# Altium project IMU sensor node hardware.PrjPcb
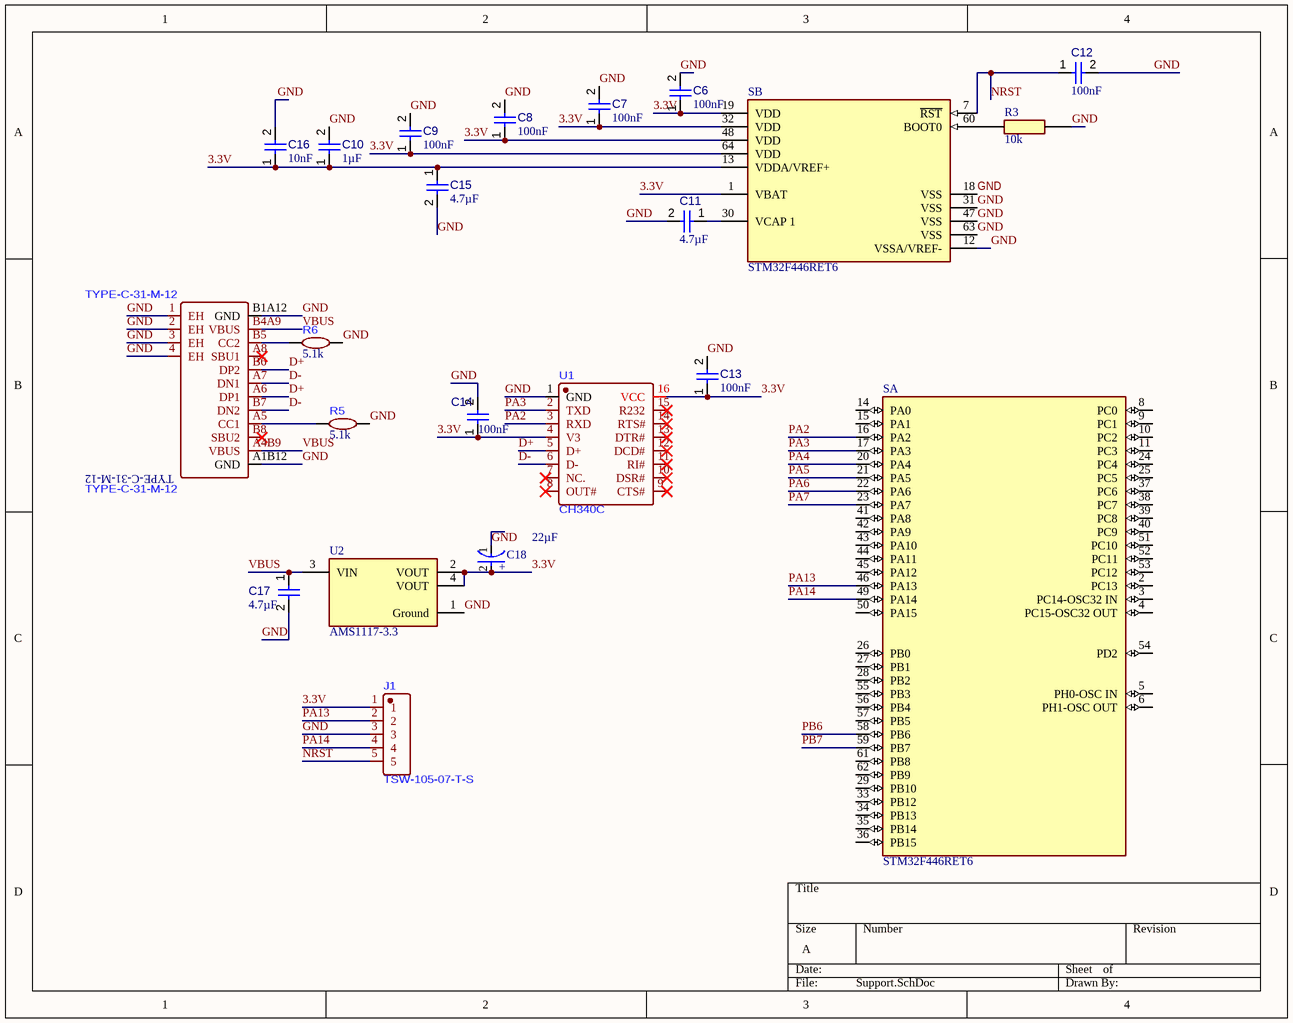
[diagram p0: Support.SchDoc]
1 sheet, 21 parts. Net scope: global (net labels, ports and power ports of the same name join across sheets).
Board file: IMU_sensor_node_hardware.PcbDoc

## Sheet Support.SchDoc
size A; SheetNumber: 1; SheetTotal: 2

### Parts
C6  value 100nF  [CAPC1608X90X40NL10T20]  (hidden comment: Capacitor 100 nF +/-10% 50 V 0603)
C7  value 100nF  [CAPC1608X90X40NL10T20]  (hidden comment: Capacitor 100 nF +/-10% 50 V 0603)
C8  value 100nF  [CAPC1608X90X40NL10T20]  (hidden comment: Capacitor 100 nF +/-10% 50 V 0603)
C9  value 100nF  [CAPC1608X90X40NL10T20]  (hidden comment: Capacitor 100 nF +/-10% 50 V 0603)
C10  value 1µF  [CAPC0603(1608)100_L]  (hidden comment: Capacitor 1µF +/-40% 50V 0603)
C11  value 4.7µF  [CAPC0603(1608)100_L]  (hidden comment: Capacitor 4.7µF +/-20% 10V 0603)
C12  value 100nF  [CAPC1608X90X40NL10T20]  (hidden comment: Capacitor 100 nF +/-10% 50 V 0603)
C13  value 100nF  [CAPC1608X90X40NL10T20]  (hidden comment: Capacitor 100 nF +/-10% 50 V 0603)
C14  value 100nF  [CAPC1608X90X40NL10T20]  (hidden comment: Capacitor 100 nF +/-10% 50 V 0603)
C15  value 4.7µF  [CAPC0603(1608)100_L]  (hidden comment: Capacitor 4.7µF +/-20% 10V 0603)
C16  value 10nF  [CAPC0402(1005)60_L]  (hidden comment: Capacitor 10nF +/-20% 50V 0402)
C17  value 4.7µF  [CAPC0603(1608)100_L]  (hidden comment: Capacitor 4.7µF +/-20% 10V 0603)
C18  value 22µF  [FP-TAJA-MFG]  (hidden comment: TAJA226M010RNJ)
J1  TSW-105-07-T-S  [PCBComponent_1]
R3  value 10k  [RESC1005X40N]  (hidden comment: 0402WGF1002TCE)
R5  value 5.1k  [PCBComponent_1]  (hidden comment: 0603WAF5101T5E)
R6  value 5.1k  [PCBComponent_1]  (hidden comment: 0603WAF5101T5E)
S  STM32F446RET6  [FP-LQFP64-5W-MFG]  (parts A,B of 2)
TYPE-C-31-M-12  TYPE-C-31-M-12  [PCBComponent_1]
U1  CH340C  [PCBComponent_1]
U2  AMS1117-3.3  [FP-AMS1117-IPC_A]

### Nets
3.3V: C6.1 C7.1 C8.1 C9.1 C10.1 C13.1 C14.1 C15.1 C16.1 C18.2(A) J1.1 S.1(VBAT) S.13(VDDA/VREF+) S.19(VDD) S.32(VDD) S.48(VDD) S.64(VDD) U1.4(V3) U1.16(VCC) U2.2(VOUT) U2.4(VOUT)
D+: TYPE-C-31-M-12.A6(DP1) TYPE-C-31-M-12.B6(DP2) U1.5(D+)
D-: TYPE-C-31-M-12.A7(DN1) TYPE-C-31-M-12.B7(DN2) U1.6(D-)
GND: C6.2 C7.2 C8.2 C9.2 C10.2 C11.2 C12.2 C13.2 C14.2 C15.2 C16.2 C17.2 C18.1(C) J1.3 R3.2 R5.2 R6.2 S.12(VSSA/VREF-) S.18(VSS) S.31(VSS) S.47(VSS) S.63(VSS) TYPE-C-31-M-12.1(EH) TYPE-C-31-M-12.2(EH) TYPE-C-31-M-12.3(EH) TYPE-C-31-M-12.4(EH) TYPE-C-31-M-12.A1B12(GND) TYPE-C-31-M-12.B1A12(GND) U1.1(GND) U2.1(Ground)
NRST: C12.1 J1.5 S.7(~{RST})
PA2: S.16(PA2) U1.3(RXD)
PA3: S.17(PA3) U1.2(TXD)
PA4: S.20(PA4)
PA5: S.21(PA5)
PA6: S.22(PA6)
PA7: S.23(PA7)
PA13: J1.2 S.46(PA13)
PA14: J1.4 S.49(PA14)
PB6: S.58(PB6)
PB7: S.59(PB7)
VBUS: C17.1 TYPE-C-31-M-12.A4B9(VBUS) TYPE-C-31-M-12.B4A9(VBUS) U2.3(VIN)
NetC11_1: C11.1 S.30(VCAP_1)
NetR3_1: R3.1 S.60(BOOT0)
NetR5_1: R5.1 TYPE-C-31-M-12.A5(CC1)
NetR6_1: R6.1 TYPE-C-31-M-12.B5(CC2)

Not connected (* = marked no-connect by the designer): S 2(PC13) 3(PC14-OSC32_IN) 4(PC15-OSC32_OUT) 5(PH0-OSC_IN) 6(PH1-OSC_OUT) 8(PC0) 9(PC1) 10(PC2) 11(PC3) 14(PA0) 15(PA1) 24(PC4) 25(PC5) 26(PB0) 27(PB1) 28(PB2) 29(PB10) 33(PB12) 34(PB13) 35(PB14) 36(PB15) 37(PC6) 38(PC7) 39(PC8) 40(PC9) 41(PA8) 42(PA9) 43(PA10) 44(PA11) 45(PA12) 50(PA15) 51(PC10) 52(PC11) 53(PC12) 54(PD2) 55(PB3) 56(PB4) 57(PB5) 61(PB8) 62(PB9); TYPE-C-31-M-12 A8(SBU1)* B8(SBU2)*; U1 7(NC.)* 8(OUT#)* 9(CTS#)* 10(DSR#)* 11(RI#)* 12(DCD#)* 13(DTR#)* 14(RTS#)* 15(R232)*

### Notes on the sheet
- (in symbol CMP-00000-1) +

### Library data of the parts
C6-C9 C12-C14 = CMP-001-00017-6: Chip Capacitor, 100 nF, +/- 10%, 50 V, 0603 (1608 Metric); Voltage Rating: 50V; Capacitor Type: Ceramic; Tolerance: 10%; Mounting Technology: SM; Max Operating Temperature: 125°C; RoHS Compliant: True; Pins: 2; Case/Package: 0603; Min Operating Temperature: -55°C
C10 = CMP-001-00078-4: Chip Capacitor, 1µF +/-40%, 50V, 0603, Thickness 1 mm; Tolerance: 10%; Case/Package: 0603; Pins: 2; Max Operating Temperature: 85°C; Voltage Rating: 50V; Mounting Technology: SMT; Min Operating Temperature: -55°C
C11 C15 C17 = CMP-001-00076-4: Chip Capacitor, 4.7µF +/-20%, 10V, 0603, Thickness 1 mm; Tolerance: 10%; Mounting Technology: SMT; Case/Package: 0603; Pins: 2; Min Operating Temperature: -55°C; Max Operating Temperature: 85°C; Voltage Rating: 10V
C16 = CMP-001-00069-3: Chip Capacitor, 10nF +/-20%, 50V, 0402, Thickness 0.6 mm; Tolerance: 5%; Max Operating Temperature: 85°C; Pins: 2; Case/Package: 0402; Voltage Rating: 50V; Min Operating Temperature: -55°C; Mounting Technology: SMT
C18 = CMP-00000-1: Cap Tant Solid 22uF 10V A CASE 20%( 3.2 X 1.6 X 1.6mm) Inward L SMD 3216-18 3 Ohm 125C T/R; Polarity: Polar; Dielectric Material: Tantalum; Dissipation Factor: 8%; ESR (Equivalent Series Resistance): 3Ω; Life (Hours): 2000hours; Leakage Current: 2.2µA; Ripple Current: 63mA; Length: 3.2mm; Tolerance: 20%; Depth: 1.6mm; Number of Terminals: 2; Export Control Classification Number (ECCN) Code: EAR99; Voltage: 10V; Termination: SMD/SMT; Min Operating Temperature: -55°C; Mounting Technology: Surface Mount; Pins: 2; Features: General Purpose; Introduction Date: 2005-08-24; Case Code (Metric): 3216; Height: 1.6mm; Lead Pitch: 1.1mm; Case Code (Imperial): 1206; REACH SVHC: Yes; Harmonized Tariff Schedule (HTS) Code: 8532.21.00.50; Height - Seated (Max): 1.8034mm; Radiation Hardening: No; Max Operating Temperature: 125°C; Schedule B: 8532210050; Country of Origin: Czechia, El Salvador; Voltage Rating (DC): 10V; RoHS: Compliant; Lifecycle Status: Production; China RoHS: Compliant; Case/Package: 1206; Lead Free: Lead Free; Voltage Rating: 10V; Width: 1.6mm
J1 = CMP-00032-1: CONN HEADER VERT 5POS 2.54MM / Connector Header Through Hole 5 position 0.100" (2.54mm); Manufacturer Lifecycle Status: PRODUCTION; Max Voltage Rating (AC): 550V; Gender: Male; Connector Type: Male Pin; Number of Positions: 5; Max Current Rating: 7.6A; Lead Free: Lead Free; Lifecycle Status: Production; Contact Plating: Tin; Termination: Solder; Housing Color: Black; Number of Rows: 1; RoHS: Compliant; REACH SVHC: No; Mounting Technology: Through Hole; Contact Mating Length: 5.842mm; Orientation: Straight; Pitch: 2.54mm; Contact Material: Bronze; Radiation Hardening: No; Min Operating Temperature: -55°C; Packaging: Bulk; Length: 12.7mm; Lead Pitch: 2.54mm; Width: 2.54mm; Depth: 2.54mm; Max Operating Temperature: 105°C; Housing Material: Polyester; Color: Black; Number of Contacts: 5
R3 = CMP-00018-1: Res Thick Film 0402 10K Ohm 1% 0.063W(1/16W) ±100ppm/C Pad SMD T/R; Temperature Coefficient: 100ppm/°C; Power Rating: 62.5mW; Working Voltage: 50V; Number of Terminals: 2; Max Operating Temperature: 155°C; Composition: Thick Film; Mounting Technology: Surface Mount; Width: 500µm; RoHS: Compliant; Length: 1mm; Height: 350µm; Min Operating Temperature: -55°C; REACH SVHC: Yes; Lifecycle Status: Production; Tolerance: 1%; China RoHS: Non-Compliant; Case/Package: 0402
R5 R6 = CMP-00031-1: Res Thick Film 0603 5.1K Ohm 1% 0.1W(1/10W) ±100ppm/C Pad SMD T/R
S = CMP-00001-1: MCU 32-bit ARM Cortex M4 RISC 512KB Flash 2.5V/3.3V Medical 64-Pin LQFP Frame; Max Junction Temperature (Tj): 105°C; Data Bus Width: 32b; Number of A/D Converters: 3; Min Supply Voltage: 1.7V; EEPROM Memory Size: 0B; Nominal Supply Current: 1.12µA; Peripherals: LCD, POR; Number of D/A Converters: 2; Number of Programmable I/O: 50; RAM Size: 128kB; Number of Channels: 16; Max Supply Voltage: 3.6V; Number of USART Channels: 4; Frequency: 180MHz; Max Power Dissipation: 345mW; Max Supply Current: 115mA; Interface: IrDA, LIN, USB; Clock Frequency: 16MHz; ADC Channels (Resolution): 16-Ch 12-Bit; Core Architecture: ARM Cortex-M4; DAC Channels (Resolution): 2-Ch 12-Bit; Watchdog Timer: Yes; Oscillator Type: Internal; Nominal Supply Voltage (DC): 3.3V; Flash Memory Size: 512kB; Lead Free: Lead Free; Export Control Classification Number (ECCN) Code: 3A991.A.2; Length: 10mm; Height: 1.6mm; Mounting Technology: Surface Mount; Number of SPI Channels: 3; Temperature Grade: Industrial; Pins: 64; Number of I/Os: 50; Ambient Temperature Range High: 85°C; Case/Package: QFP; Terminal Pitch: 500µm; Number of Terminals: 64; China RoHS: Compliant; RoHS: Compliant; Harmonized Tariff Schedule (HTS) Code: 8542.31.00.25; Number of Timers/Counters: 2; Width: 10mm; Number of PWM Channels: 4; REACH SVHC: Yes; Schedule B: 8542310000, 8542310000; Lifecycle Status: Production; Number of USB Channels: 2; Memory Format: FLASH; Min Operating Temperature: -40°C; Memory Size: 512kB; Introduction Date: 2015-03-16; Number of ADC Channels: 16; Max Operating Temperature: 85°C; Country of Origin: Mainland China, Philippines, Taiwan; Number of UART Channels: 2; Number of I2C Channels: 4
TYPE-C-31-M-12 = CMP-00023-1: 20V Type-C 1 16P Female head
U1 = CMP-00027-1: uart to usb c
U2 = CMP-00028-1: Gull Wing EAR99 Fixed Positive Single Output Ldo Regulator Dual Voltage Regulator Linear 125C 1.2W 1A 1.8MM; Output Voltage: 3.3V; Max Supply Voltage: 15V; Dropout Voltage: 1.1V; Number of Outputs: 1; Max Junction Temperature (Tj): 125°C; Nominal Supply Current: 5mA; Height: 1.8mm; RoHS: Compliant; Min Operating Temperature: -40°C; Case/Package: SOT-223; Max Operating Temperature: 125°C; Output Current: 1A; Max Power Dissipation: 1.2W; Pins: 2